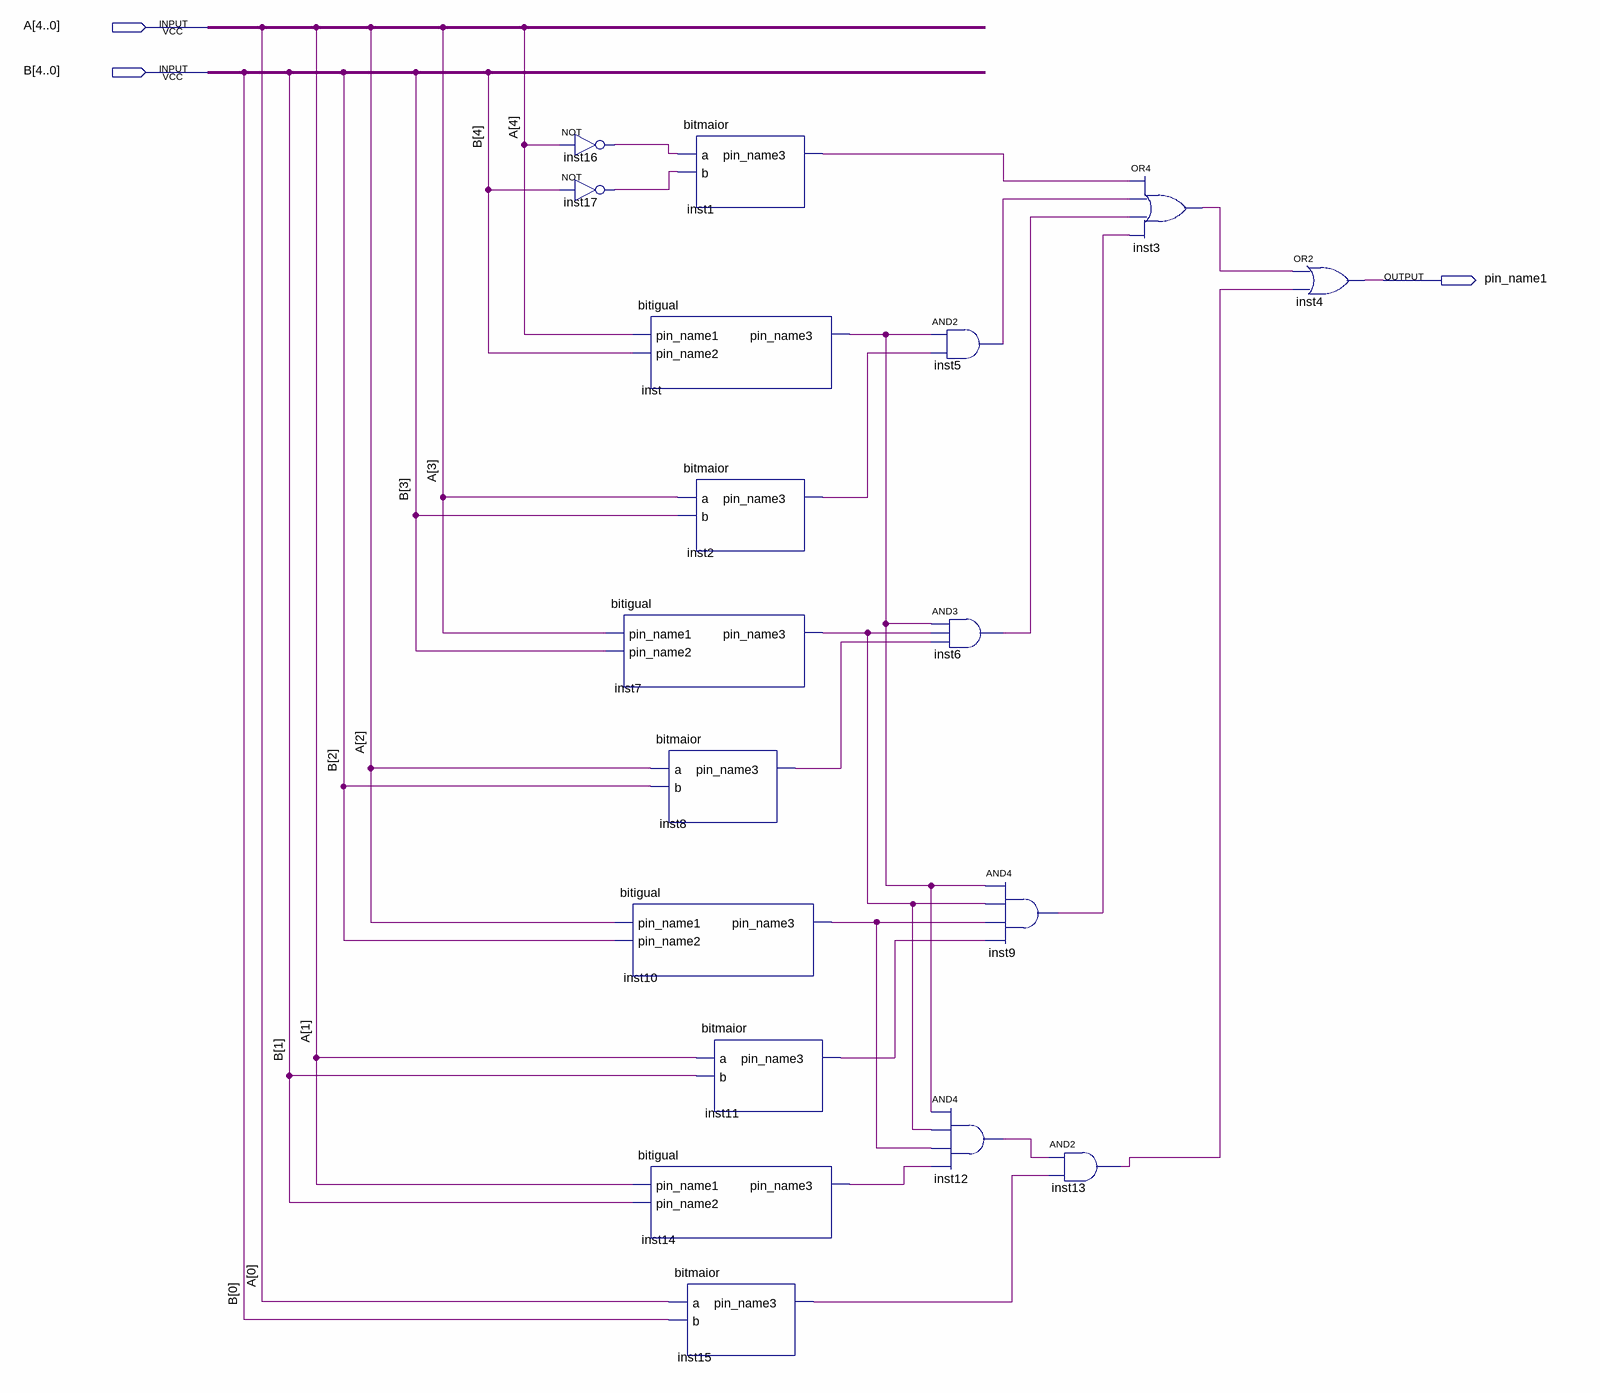
[diagram p0: schematic sheet]
// Quartus schematic numeromaior.bdf as structural Verilog: 18 symbols, 3 pins
module numeromaior (
  input  [4:0] A,
  input  [4:0] B,
  output pin_name1
);

  wire inst1_pin_name3, inst2_pin_name3, inst3_out, inst5_out, inst6_out, inst7_pin_name3, inst8_pin_name3,
       inst9_out, inst10_pin_name3, inst11_pin_name3, inst12_out, inst13_out, inst14_pin_name3,
       inst15_pin_name3, inst16_out, inst17_out, inst_pin_name3;

  not inst16 (inst16_out, A[4]);
  not inst17 (inst17_out, B[4]);
  bitigual inst (.pin_name1(A[4]), .pin_name2(B[4]), .pin_name3(inst_pin_name3));
  bitigual inst7 (.pin_name1(A[3]), .pin_name2(B[3]), .pin_name3(inst7_pin_name3));
  bitigual inst10 (.pin_name1(A[2]), .pin_name2(B[2]), .pin_name3(inst10_pin_name3));
  bitigual inst14 (.pin_name1(A[1]), .pin_name2(B[1]), .pin_name3(inst14_pin_name3));
  bitmaior inst1 (.a(inst16_out), .b(inst17_out), .pin_name3(inst1_pin_name3));
  bitmaior inst2 (.a(A[3]), .b(B[3]), .pin_name3(inst2_pin_name3));
  bitmaior inst8 (.a(A[2]), .b(B[2]), .pin_name3(inst8_pin_name3));
  bitmaior inst11 (.a(A[1]), .b(B[1]), .pin_name3(inst11_pin_name3));
  bitmaior inst15 (.a(A[0]), .b(B[0]), .pin_name3(inst15_pin_name3));
  and inst5 (inst5_out, inst_pin_name3, inst2_pin_name3);
  and inst6 (inst6_out, inst_pin_name3, inst7_pin_name3, inst8_pin_name3);
  and inst9 (inst9_out, inst_pin_name3, inst7_pin_name3, inst10_pin_name3, inst11_pin_name3);
  and inst12 (inst12_out, inst_pin_name3, inst7_pin_name3, inst10_pin_name3, inst14_pin_name3);
  and inst13 (inst13_out, inst12_out, inst15_pin_name3);
  or inst3 (inst3_out, inst1_pin_name3, inst5_out, inst6_out, inst9_out);
  or inst4 (pin_name1, inst3_out, inst13_out);
endmodule
